# Altium schematic sheet SDCardButtonLed.SchDoc
size A4; Date: 27.05.2014; Author: AOM1; DrawnBy: AOM1; Organization: BFH; Address1: Berner Fachhochschule; Address2: Technik und Informatik; Address3: Jlcoweg 1; Address4: 3400 Burgdorf; DocumentNumber: 1; Revision: 1.0; SheetNumber: 3; SheetTotal: 6; CurrentDate: 27.05.2014
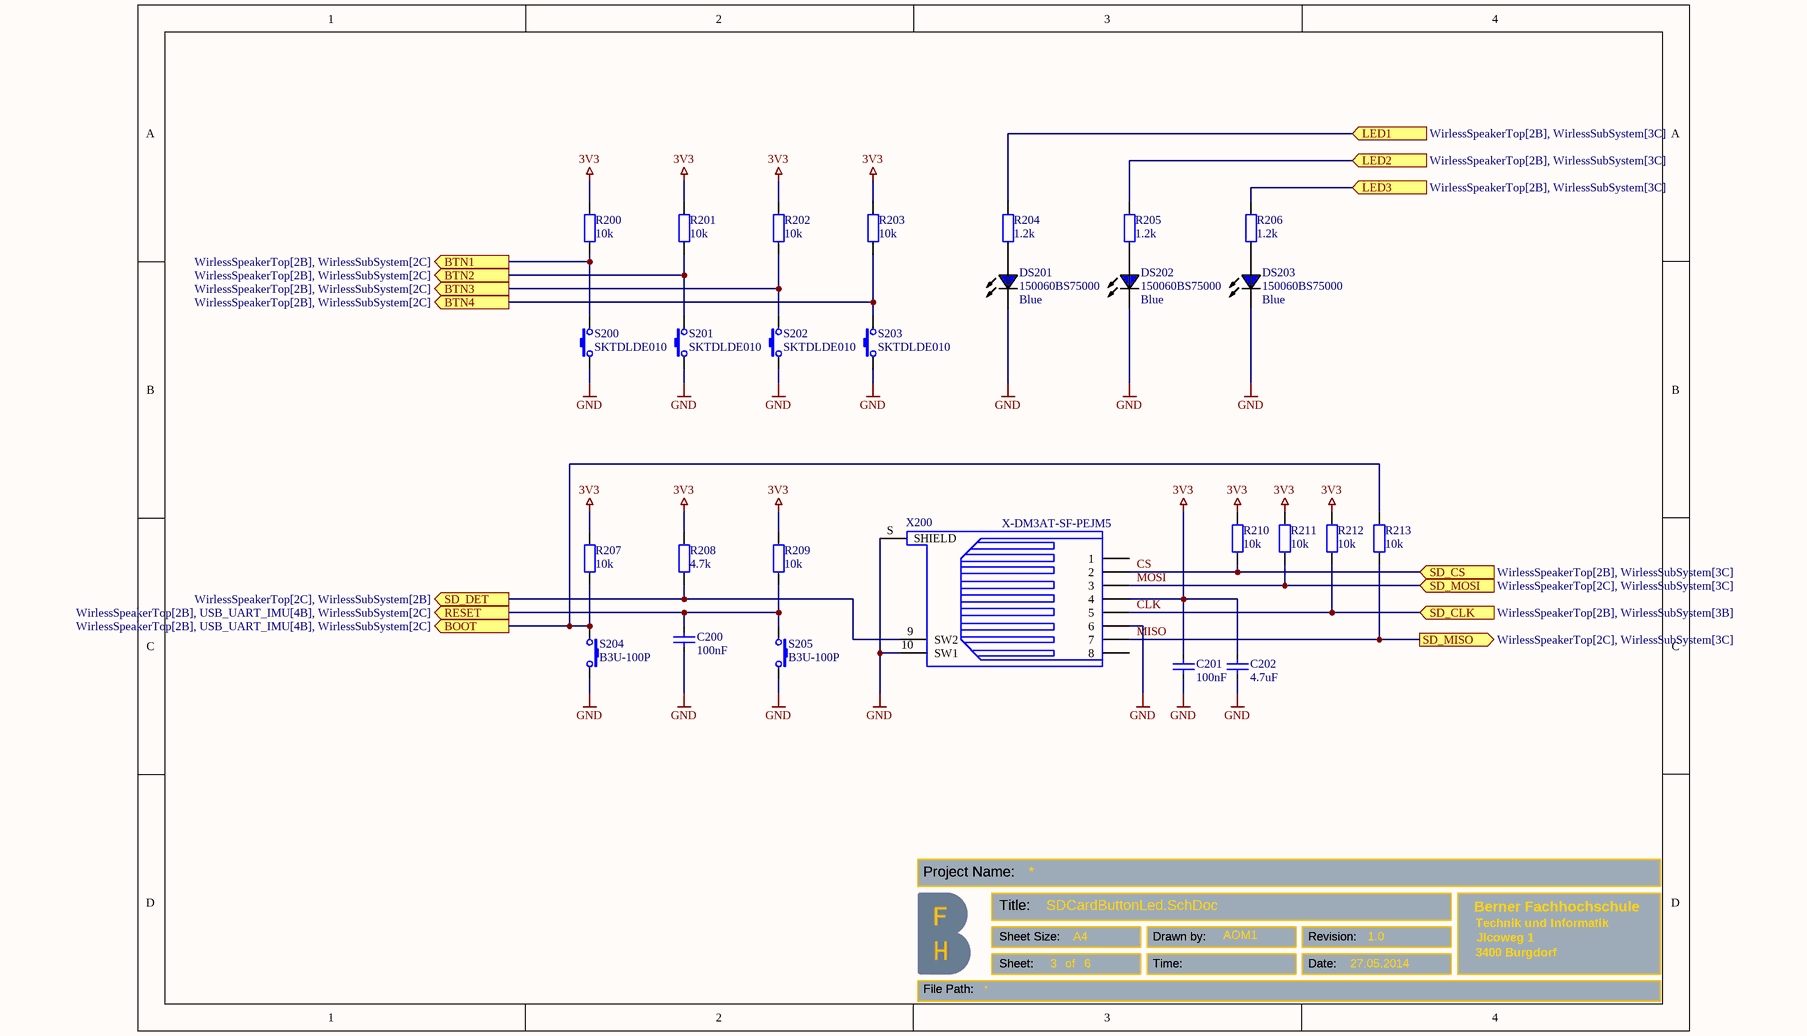
[diagram p0: SDCardButtonLed.SchDoc]

## Parts
C200  100nF  [C-0603]
C201  100nF  [C-0603]
C202  4.7uF  [C-0603]
DS201  150060BS75000  value Blue  [LED-0603-BLUE]
DS202  150060BS75000  value Blue  [LED-0603-BLUE]
DS203  150060BS75000  value Blue  [LED-0603-BLUE]
R200  10k  [R-0603]
R201  10k  [R-0603]
R202  10k  [R-0603]
R203  10k  [R-0603]
R204  1.2k  [R-0603]
R205  1.2k  [R-0603]
R206  1.2k  [R-0603]
R207  10k  [R-0603]
R208  4.7k  [R-0603]
R209  10k  [R-0603]
R210  10k  [R-0603]
R211  10k  [R-0603]
R212  10k  [R-0603]
R213  10k  [R-0603]
S200  SKTDLDE010  [S-SKTDLDE010]
S201  SKTDLDE010  [S-SKTDLDE010]
S202  SKTDLDE010  [S-SKTDLDE010]
S203  SKTDLDE010  [S-SKTDLDE010]
S204  B3U-100P  [S-B3U-100X]
S205  B3U-100P  [S-B3U-100X]
X200  X-DM3AT-SF-PEJM5  [X-DM3AT-SF-PEJM5]

## Ports
BOOT (out, see WirlessSpeakerTop[2B], USB_UART_IMU[4B], WirlessSubSystem[2C]), BTN1 (out, see WirlessSpeakerTop[2B], WirlessSubSystem[2C]), BTN2 (out, see WirlessSpeakerTop[2B], WirlessSubSystem[2C]), BTN3 (out, see WirlessSpeakerTop[2B], WirlessSubSystem[2C]), BTN4 (out, see WirlessSpeakerTop[2B], WirlessSubSystem[2C]), LED1 (in, see WirlessSpeakerTop[2B], WirlessSubSystem[3C]), LED2 (in, see WirlessSpeakerTop[2B], WirlessSubSystem[3C]), LED3 (in, see WirlessSpeakerTop[2B], WirlessSubSystem[3C]), RESET (out, see WirlessSpeakerTop[2B], USB_UART_IMU[4B], WirlessSubSystem[2C]), SD_CLK (in, see WirlessSpeakerTop[2B], WirlessSubSystem[3B]), SD_CS (in, see WirlessSpeakerTop[2B], WirlessSubSystem[3C]), SD_DET (out, see WirlessSpeakerTop[2C], WirlessSubSystem[2B]), SD_MISO (out, see WirlessSpeakerTop[2C], WirlessSubSystem[3C]), SD_MOSI (in, see WirlessSpeakerTop[2C], WirlessSubSystem[3C])

## Nets
3V3: C201.2 C202.2 R200.2 R201.2 R202.2 R203.2 R207.2 R208.2 R209.2 R210.2 R211.2 R212.2 X200.4
GND: C200.1 C201.1 C202.1 DS201.K DS202.K DS203.K S200.1 S201.1 S202.1 S203.1 S204.2 S205.2 X200.6 X200.10(SW1) X200.S(SHIELD)
BOOT: R207.1 R213.2 S204.1 ; port BOOT
BTN1: R200.1 S200.2 ; port BTN1
BTN2: R201.1 S201.2 ; port BTN2
BTN3: R202.1 S202.2 ; port BTN3
BTN4: R203.1 S203.2 ; port BTN4
CLK: R212.1 X200.5 ; port SD_CLK
CS: R210.1 X200.2 ; port SD_CS
LED1: R204.2 ; port LED1
LED2: R205.2 ; port LED2
LED3: R206.2 ; port LED3
MISO: R213.1 X200.7 ; port SD_MISO
MOSI: R211.1 X200.3 ; port SD_MOSI
RESET: C200.2 R209.1 S205.1 ; port RESET
SD_DET: R208.1 X200.9(SW2) ; port SD_DET
NetDS201_A: DS201.A R204.1
NetDS202_A: DS202.A R205.1
NetDS203_A: DS203.A R206.1

Not connected (* = marked no-connect by the designer): X200 1 8

## Notes on the sheet
- Project Name:
- Title:
- Sheet Size:
- Sheet:
- of
- A4
- Drawn by:
- Time:
- Revision:
- Date:
- File Path:

## Library data of the parts
C200-C202 = C-SMD-0603: Multilayer Ceramic Capacitors MLCC; Manufacturer: Murata Electronics; Mfr. Part No.: GRM18...; Order-Code: 81-GRM18...; Price (CHF): 0.12; Distributor: Mouser; Added: 28.08.2018; ComponentLink1Description: Chip Multilayer Ceramic Capacitors; ComponentLink1URL: https://www.mouser.ch/datasheet/2/281/murata_03052018_GRM_Series_1-1310166.pdf; Notice: -; Mounting Style: SMD/SMT; Package: 0603
DS201-DS203 = DS-LED-BLUE: Standard LEDs - SMD 0603 Blue; Manufacturer: Wurth Elektronik; Order-Code: 710-150060BS75000; Distributor: Mouser; Price (CHF): 0.105; Added: 06.08.2021; Package: 0603; Mounting Style: SMD/SMT; Notice: -; Mfr. Part No.: 150060BS75000
R200-R213 = R-SMD-0603: Thin Film Resistors - SMD  0.1W  1%; Mfr. Part No.: MCU08050C*; Manufacturer: Vishay / Beyschlag; Order-Code: BFH-Lager; Price (CHF): 0.1; Distributor: Mouser; Notice: -; Added: 10.11.2012; Mounting Style: SMD/SMT; Package: 0603
S200-S203 = S-Tactile-Switch: Tactile Switches 6x6 Flat 4.3mm Btn Force 100g w/o Grd; Manufacturer: ALPS; Order-Code: 688-SKTDLDE010; Distributor: Mouser; Price (CHF): 0.43; Added: 28.08.2018; ComponentLink1Description: Tactile Switch; ComponentLink1URL: http://www.farnell.com/datasheets/2082873.pdf?_ga=2.143512053.1712594784.1535524557-997716388.1524486210; Mfr. Part No.: SKTDLDE010; Notice: -; Package: LxWxH 3.9x2.9x1.55mm; Mounting Style: SMD/SMT
S204 S205 = S-B3U-100P: Tactile Switches Top Actuated w/o boss w/o ground; Manufacturer: OMRON ELECTRONIC COMPONENTS; Mfr. Part No.: B3U-1000P; Order-Code: 653-B3U-1000P; Price (CHF): 0.772; Added: 28.08.2018; Distributor: Mouser; ComponentLink1Description: Ultra-small Tactile Switch (SMT); ComponentLink1URL: http://www.farnell.com/datasheets/2610940.pdf?_ga=2.224737754.1712594784.1535524557-997716388.1524486210; Notice: -; Package: 2.5x3mm; Mounting Style: SMD/SMT
X200 = X-DM3AT-SF-PEJM5: SMTMicro SD 8 Pin PCB; Manufacturer: Hirose Electric Co Ltd; Order-Code: 798-DM3AT-SF-PEJM5; Distributor: Mouser; Price (CHF): 1.8; Mfr. Part No.: DM3AT-SF-PEJM5; Added: 08.08.2021; Package: DM3AT-SF-PEJM5; Notice: -; Mounting Style: SMD/SMT